# Altium project Q24_ECU_REWORK.PrjPcb (part 2 of 2)

## Sheet IMU.SchDoc
size A4
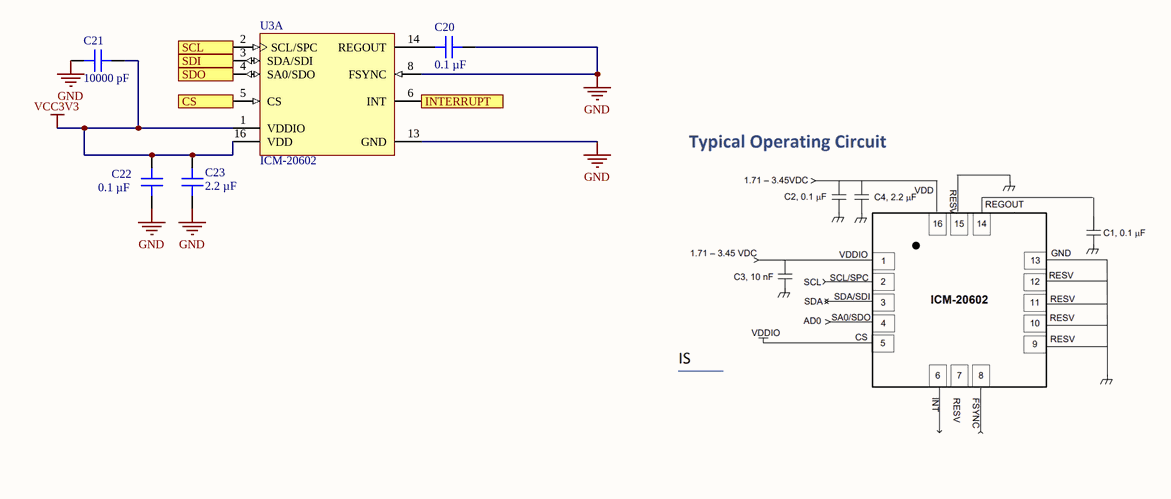
[diagram p12: IMU.SchDoc]

### Parts
C20  0.1 µF  [CAP 0603_1608]
C21  10000 pF  [CAP 0603_1608]
C22  0.1 µF  [CAP 0603_1608]
C23  2.2 µF  [CAP 0603_1608]
U3  ICM-20602  [INSE-I62-16]  (part A of 2)

### Ports
CS, INTERRUPT, SCL, SDI, SDO

### Nets
GND: C20.2 C21.1 C22.1 C23.1 U3.8(FSYNC) U3.13(GND)
VCC3V3: C21.2 C22.2 C23.2 U3.1(VDDIO) U3.16(VDD)
NetC20_1: C20.1 U3.14(REGOUT)
NetU3_2: U3.2(SCL/SPC) ; port SCL
NetU3_3: U3.3(SDA/SDI) ; port SDI
NetU3_4: U3.4(SA0/SDO) ; port SDO
NetU3_5: U3.5(CS) ; port CS
NetU3_6: U3.6(INT) ; port INTERRUPT

### Library data of the parts
C20 C22 = C0603C104K5RAC7411: CAP CER 0.1UF 50V X7R 0603; manufacturer: KEMET; Tolerance: ±10%; Part Number: C0603C104K5RAC7411; Value: 0.1 µF; Applications: Bypass, Decoupling; Capacitance: 0.1 µF; componentlink1description: Datasheet; componentlink1url: https://api.kemet.com/component-edge/download/datasheet/C0603C104K5RAC7411.pdf; componentlink2description: DigiKey Link; componentlink2url: https://www.digikey.com/en/products/detail/kemet/C0603C104K5RAC7411/3317013; Device Package: 0603 (1608 Metric); lastupdated: 2023-06-07 7:13:18 PM; Lifecycle Status: Active; Minimum Order: 1; Mounting Type: Surface Mount, MLCC; Operating Temperature: -55°C ~ 125°C; Package / Case: 0603 (1608 Metric); packaging: TapeAndReel; partid: 2233; Part Status: Active; price: 0.01; series: SMD Comm X7R; Size / Dimension: 0.063" L x 0.031" W (1.60mm x 0.80mm); Supplier 1: DigiKey; Supplier Part Number 1: 399-C0603C104K5RAC7411CT-ND; Temperature Coefficient: X7R; Thickness (Max): 0.035" (0.90mm); Voltage - Rated: 50V
C21 = C0603C103K4RECAUTO: CAP CER 0603 10NF 16V X7R 10%; manufacturer: KEMET; Part Number: C0603C103K4RECAUTO; Value: 10000 pF; Applications: Automotive, ESD Protection; Capacitance: 10000 pF; componentlink1description: Datasheet; componentlink1url: https://api.kemet.com/component-edge/download/datasheet/C0603C103K4RECAUTO.pdf; componentlink2description: DigiKey Link; componentlink2url: https://www.digikey.com/en/products/detail/kemet/C0603C103K4RECAUTO/8640474; Device Package: 0603 (1608 Metric); lastupdated: 2023-06-07 7:13:03 PM; Lifecycle Status: Active; Minimum Order: 1; Mounting Type: Surface Mount, MLCC; Operating Temperature: -55°C ~ 125°C; Package / Case: 0603 (1608 Metric); packaging: TapeAndReel; partid: 8251; Part Status: Active; price: 0.01; Ratings: AEC-Q200; series: ESD SMD Auto X7R; Size / Dimension: 0.063" L x 0.031" W (1.60mm x 0.80mm); Supplier 1: DigiKey; Supplier Part Number 1: 399-17880-1-ND; Temperature Coefficient: X7R; Thickness (Max): 0.034" (0.87mm); Tolerance: ±10%; Voltage - Rated: 16V
C23 = CC0603ZRY5V6BB225: CAP CER 2.2UF 10V Y5V 0603; manufacturer: Yageo; Temperature Coefficient: Y5V (F); Tolerance: -20%, +80%; Part Number: CC0603ZRY5V6BB225; Value: 2.2 µF; Applications: General Purpose; Capacitance: 2.2 µF; componentlink1description: Datasheet; componentlink1url: http://www.yageo.com/documents/recent/UPY-GPHC_Y5V_6.3V-to-50V_8.pdf; componentlink2description: DigiKey Link; componentlink2url: https://www.digikey.com/en/products/detail/yageo/CC0603ZRY5V6BB225/2833615; Device Package: 0603 (1608 Metric); lastupdated: 2023-06-07 7:13:18 PM; Lifecycle Status: Active; Minimum Order: 1; Mounting Type: Surface Mount, MLCC; Operating Temperature: -30°C ~ 85°C; Package / Case: 0603 (1608 Metric); packaging: TapeAndReel; partid: 2248; Part Status: Active; price: 0.01; series: CC; Size / Dimension: 0.063" L x 0.031" W (1.60mm x 0.80mm); Supplier 1: DigiKey; Supplier Part Number 1: 311-1450-1-ND; Thickness (Max): 0.035" (0.90mm); Voltage - Rated: 10V
U3 = CMP-2000-07589-1: High Performance 6-Axis MEMS MotionTracking(TM) Device, 1.71 to 3.45 V, -40 to 85 degC, 16-Pin LGA, RoHS; Manufacturer: InvenSense; Sensor Type: Temperature; Output Type: I2C; RoHSCompliant: True; Datasheet Version: Rev. 1.0, 10/2016; Datasheet URL: http://www.invensense.com/wp-content/uploads/2016/10/DS-000176-ICM-20602-v1.0.pdf; Min Operating Temperature: -40degC; Mounting Technology: SurfaceMount; Max Operating Temperature: 85degC; Manufacturer URL: http://www.invensense.com/; Package Reference: I62-16; Package Description: 16-Pin Land Grid Array, Body 3 x 3 mm, Pitch 0.5 mm

## Sheet 5VBulkhead.SchDoc
size A4
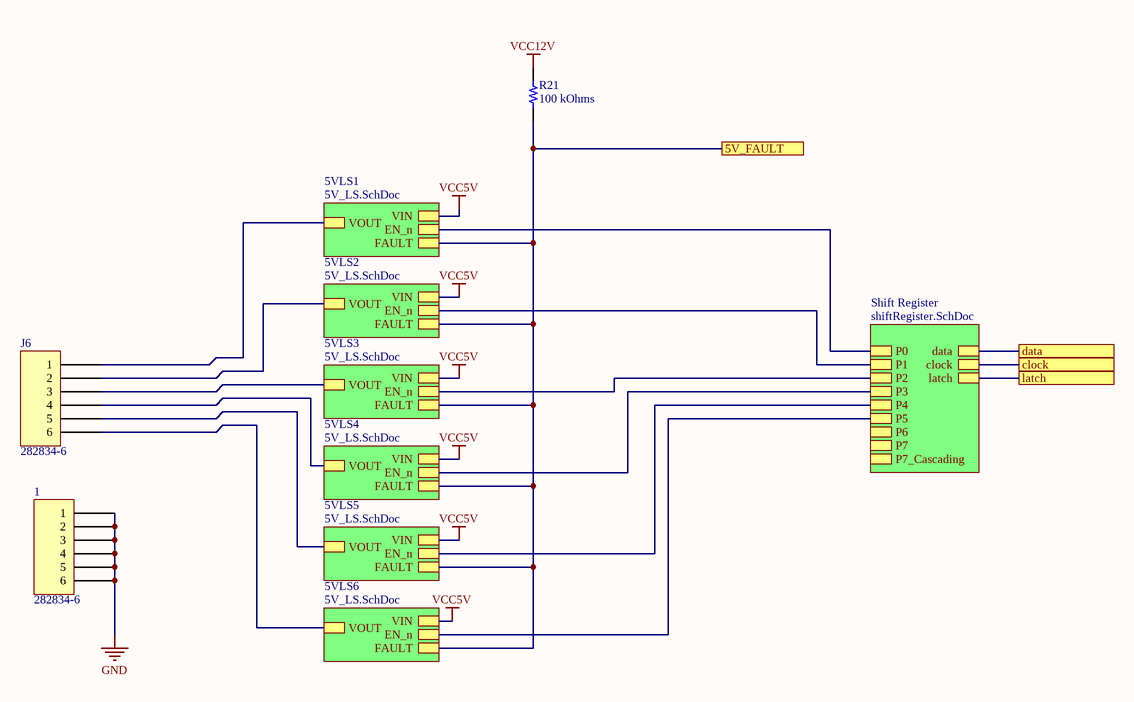
[diagram p13: 5VBulkhead.SchDoc]

### Parts
1  282834-6  [TE 282834-6]
J6  282834-6  [TE 282834-6]
R21  100 kOhms  [RES 0603_1608]

### Sub-sheets
5VLS1 = 5V_LS.SchDoc: VIN, VOUT, EN_n, FAULT
5VLS2 = 5V_LS.SchDoc: VIN, VOUT, EN_n, FAULT
5VLS3 = 5V_LS.SchDoc: VIN, VOUT, EN_n, FAULT
5VLS4 = 5V_LS.SchDoc: VIN, VOUT, EN_n, FAULT
5VLS5 = 5V_LS.SchDoc: VIN, VOUT, EN_n, FAULT
5VLS6 = 5V_LS.SchDoc: VIN, VOUT, EN_n, FAULT
Shift Register = shiftRegister.SchDoc: P0, P1, P2, P3, P4, P5, P6, P7, P7_Cascading, data, clock, latch

### Ports
5V_FAULT, clock, data, latch

### Nets
GND: 1.1 1.2 1.3 1.4 1.5 1.6
VCC5V: sheet 5VLS1/VIN, sheet 5VLS2/VIN, sheet 5VLS3/VIN, sheet 5VLS4/VIN, sheet 5VLS5/VIN, sheet 5VLS6/VIN
VCC12V: R21.2
NetC25_5VLS1_2: J6.1 ; sheet 5VLS1/VOUT
NetC25_5VLS2_2: J6.2 ; sheet 5VLS2/VOUT
NetC25_5VLS3_2: J6.3 ; sheet 5VLS3/VOUT
NetC25_5VLS4_2: J6.4 ; sheet 5VLS4/VOUT
NetC25_5VLS5_2: J6.5 ; sheet 5VLS5/VOUT
NetC25_5VLS6_2: J6.6 ; sheet 5VLS6/VOUT
NetIC2_5VLS1_3: sheet Shift Register/P0, sheet 5VLS1/EN_n
NetIC2_5VLS1_8: R21.1 ; port 5V_FAULT, sheet 5VLS1/FAULT, sheet 5VLS2/FAULT, sheet 5VLS3/FAULT, sheet 5VLS4/FAULT, sheet 5VLS5/FAULT, sheet 5VLS6/FAULT
NetIC2_5VLS2_3: sheet Shift Register/P1, sheet 5VLS2/EN_n
NetIC2_5VLS3_3: sheet Shift Register/P2, sheet 5VLS3/EN_n
NetIC2_5VLS4_3: sheet Shift Register/P3, sheet 5VLS4/EN_n
NetIC2_5VLS5_3: sheet Shift Register/P4, sheet 5VLS5/EN_n
NetIC2_5VLS6_3: sheet Shift Register/P5, sheet 5VLS6/EN_n
NetU4_11: port clock, sheet Shift Register/clock
NetU4_12: port latch, sheet Shift Register/latch
NetU4_14: port data, sheet Shift Register/data

### Library data of the parts
1 J6 = 282834-6: TERM BLK 6P SIDE ENT 2.54MM PCB; Manufacturer: TE Connectivity AMP Connectors; Current: 10A; Mating Orientation: Horizontal with Board; Number of Levels: 1; Pitch: 0.100" (2.54mm); Positions Per Level: 6; Voltage: 150V; Wire Gauge: 16-30 AWG; Wire Termination: Screw - Rising Cage Clamp; Part Number: 282834-6; Color: Green; ComponentLink1Description: Datasheet; ComponentLink1URL: https://www.te.com/commerce/DocumentDelivery/DDEController?Action=srchrtrv&DocNm=282834&DocType=Customer+Drawing&DocLang=English; ComponentLink2Description: DigiKey Link; ComponentLink2URL: http://digikey.com/product-detail/en/te-connectivity-amp-connectors/282834-6/A98337-ND/1153267; LastUpdated: 2020-01-15 4:16:31 AM; Lifecycle Status: Active; Minimum Order: 1; Mounting Type: Through Hole; Packaging: Bulk; Part Status: Active; Price: 4.72; Series: Buchanan; Supplier 1: DigiKey; Supplier Part Number 1: A98337-ND
R21 = RNCS0603BKE100K: RES 100K OHM 0.1% 1/16W 0603; Manufacturer: Stackpole Electronics Inc; Power (Watts): 0.063W, 1/16W; Temperature Coefficient: ±25ppm/°C; Part Number: RNCS0603BKE100K; Value: 100 kOhms; ComponentLink1Description: Datasheet; ComponentLink1URL: https://www.seielect.com/catalog/sei-rncs_rnch.pdf; ComponentLink2Description: DigiKey Link; ComponentLink2URL: https://www.digikey.com/en/products/detail/stackpole-electronics-inc/RNCS0603BKE100K/1708835; Composition: Thin Film; Device Package: 0603 (1608 Metric); Features: Anti-Corrosive, Automotive AEC-Q200, Moisture Resistant; Height - Seated (Max): 0.022" (0.55mm); LastUpdated: 2023-06-08 7:45:17 PM; Lifecycle Status: Active; Minimum Order: 1; Number of Terminations: 2; Operating Temperature: -55°C ~ 155°C; Package / Case: 0603 (1608 Metric); Packaging: TapeAndReel; PartId: 4849; Part Status: Active; Price: 0.07; Ratings: AEC-Q200; Resistance: 100 kOhms; Series: RNCS; Size / Dimension: 0.061" L x 0.031" W (1.55mm x 0.80mm); Supplier 1: DigiKey; Supplier Part Number 1: RNCS0603BKE100KCT-ND; Supplier Device Package: 0603; Tolerance: ±0.1%

## Sheet 5V_LS.SchDoc
size A4
Used 6 times, as channels 5VLS1, 5VLS2, 5VLS3, 5VLS4, 5VLS5, 5VLS6. Parts and nets are listed once, with the designators drawn on the sheet.
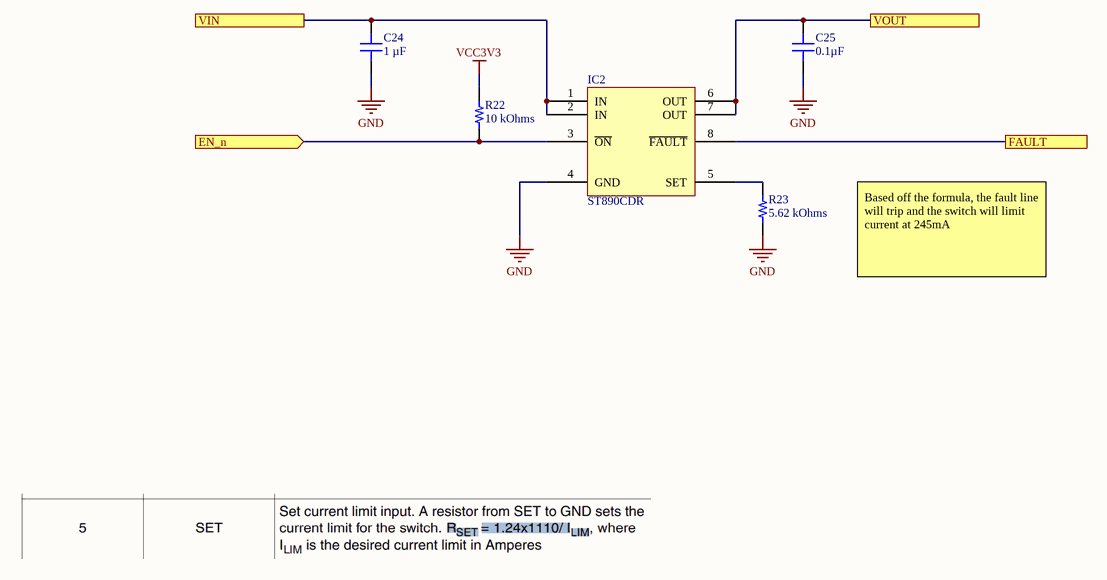
[diagram p14: 5V_LS.SchDoc]

### Parts
C24  1 µF  [CAP 0402_1005]
C25  0.1µF  [CAP 0402_1005]
IC2  ST890CDR  [ST SOIC-8N]
R22  10 kOhms  [RES 0402_1005]
R23  5.62 kOhms  [RES 0402_1005]

### Ports
EN_n (in), FAULT, VIN, VOUT

### Nets
GND: C24.1 C25.1 IC2.4(GND) R23.1
VCC3V3: R22.2
EN_n: IC2.3(~{ON}) R22.1 ; port EN_n
FAULT: IC2.8(~{FAULT}) ; port FAULT
VIN: C24.2 IC2.1(IN) IC2.2(IN) ; port VIN
VOUT: C25.2 IC2.6(OUT) IC2.7(OUT) ; port VOUT
NetIC2_5: IC2.5(SET) R23.2

### Channels
5VLS1: designators end in _5VLS1; ports EN_n=NetIC2_5VLS1_3 FAULT=NetIC2_5VLS1_8 VIN=VCC5V VOUT=NetC25_5VLS1_2
5VLS2: designators end in _5VLS2; ports EN_n=NetIC2_5VLS2_3 FAULT=NetIC2_5VLS1_8 VIN=VCC5V VOUT=NetC25_5VLS2_2
5VLS3: designators end in _5VLS3; ports EN_n=NetIC2_5VLS3_3 FAULT=NetIC2_5VLS1_8 VIN=VCC5V VOUT=NetC25_5VLS3_2
5VLS4: designators end in _5VLS4; ports EN_n=NetIC2_5VLS4_3 FAULT=NetIC2_5VLS1_8 VIN=VCC5V VOUT=NetC25_5VLS4_2
5VLS5: designators end in _5VLS5; ports EN_n=NetIC2_5VLS5_3 FAULT=NetIC2_5VLS1_8 VIN=VCC5V VOUT=NetC25_5VLS5_2
5VLS6: designators end in _5VLS6; ports EN_n=NetIC2_5VLS6_3 FAULT=NetIC2_5VLS1_8 VIN=VCC5V VOUT=NetC25_5VLS6_2

### Notes on the sheet
- Based off the formula, the fault line will trip and the switch will limit current at 245mA

### Library data of the parts
C24 = GRM155C71A105KE11D: CAP CER 1UF 10V X7S 0402; manufacturer: Murata Electronics; Tolerance: ±10%; Part Number: GRM155C71A105KE11D; Value: 1 µF; Applications: General Purpose; Capacitance: 1 µF; componentlink1description: Datasheet; componentlink1url: https://search.murata.co.jp/Ceramy/image/img/A01X/G101/ENG/GRM155C71A105KE11-01.pdf; componentlink2description: DigiKey Link; componentlink2url: https://www.digikey.com/en/products/detail/murata-electronics/GRM155C71A105KE11D/6606086; Device Package: 0402 (1005 Metric); lastupdated: 2023-06-04 7:05:15 PM; Lifecycle Status: Active; Minimum Order: 1; Mounting Type: Surface Mount, MLCC; Operating Temperature: -55°C ~ 125°C; Package / Case: 0402 (1005 Metric); packaging: TapeAndReel; partid: 1749; Part Status: Active; price: 0.01; series: GRM; Size / Dimension: 0.039" L x 0.020" W (1.00mm x 0.50mm); Supplier 1: DigiKey; Supplier Part Number 1: 490-14457-1-ND; Temperature Coefficient: X7S; Thickness (Max): 0.024" (0.60mm); Voltage - Rated: 10V
C25 = 0402ZC104KAT2A: CAP CER 0.1UF 10V X7R 0402; manufacturer: AVX Corporation; Tolerance: ±10%; Part Number: 0402ZC104KAT2A; Value: 0.1µF; Applications: General Purpose; Capacitance: 0.1µF; componentlink1description: Datasheet; componentlink1url: http://datasheets.avx.com/X7RDielectric.pdf; componentlink2description: DigiKey Link; componentlink2url: http://digikey.com/product-detail/en/avx-corporation/0402ZC104KAT2A/478-7891-1-ND/3881514; Device Package: 0402 (1005 Metric); lastupdated: 2022-02-08 12:26:59 PM; Lifecycle Status: Active; Minimum Order: 1; Mounting Type: Surface Mount, MLCC; Operating Temperature: -55°C ~ 125°C; Package / Case: 0402 (1005 Metric); packaging: TapeAndReel; partid: 1757; Part Status: Active; price: 0.09; series: -; Size / Dimension: 0.039" L x 0.020" W (1.00mm x 0.50mm); Supplier 1: DigiKey; Supplier Part Number 1: 478-7891-1-ND; Temperature Coefficient: X7R; Thickness (Max): 0.022" (0.55mm); Voltage - Rated: 10V
IC2 = ST890CDR: IC PWR SWITCH P-CHANNEL 1:1 8SO; Manufacturer: STMicroelectronics; Current - Output (Max): 1.2A; Fault Protection: Current Limiting (Adjustable), Over Temperature; Input Type: Non-Inverting; Interface: On/Off; Number of Outputs: 1; Output Configuration: High Side; Rds On (Typ): 75mOhm; Switch Type: General Purpose; Voltage - Load: 2.7V ~ 5.5V; Voltage - Supply (Vcc/Vdd): Not Required; Part Number: ST890CDR; ComponentLink1Description: Datasheet; ComponentLink1URL: http://www.st.com/content/ccc/resource/technical/document/datasheet/1a/8c/51/d8/96/28/4d/63/CD00002878.pdf/files/CD00002878.pdf/jcr:content/translations/en.CD00002878.pdf; ComponentLink2Description: DigiKey Link; ComponentLink2URL: http://digikey.com/product-detail/en/stmicroelectronics/ST890CDR/497-6543-1-ND/1865325; Device Package: 8-SOIC (0.154", 3.90mm Width); LastUpdated: 2020-05-24 9:33:45 PM; Lifecycle Status: Active; Minimum Order: 1; Mounting Type: Surface Mount; Operating Temperature: -40°C ~ 85°C (TA); Output Type: P-Channel; Package / Case: 8-SOIC (0.154", 3.90mm Width); Packaging: TapeAndReel; Part Status: Active; Price: 0.47; Ratio - Input:Output: 1:1; Series: -; Supplier 1: DigiKey; Supplier Part Number 1: 497-6543-1-ND; Supplier Device Package: 8-SO
R22 = RP73PF1E10KBTD: RES 10K OHM 0.1% 1/10W 0402; Manufacturer: TE Connectivity Passive Product; Power (Watts): 0.1W, 1/10W; Temperature Coefficient: ±25ppm/°C; Part Number: RP73PF1E10KBTD; Value: 10 kOhms; ComponentLink1Description: Datasheet; ComponentLink1URL: https://www.te.com/commerce/DocumentDelivery/DDEController?Action=srchrtrv&DocNm=1773272&DocType=DS&DocLang=English; ComponentLink2Description: DigiKey Link; ComponentLink2URL: https://www.digikey.com/en/products/detail/te-connectivity-passive-product/RP73PF1E10KBTD/8260957; Composition: Thin Film; Device Package: 0402 (1005 Metric); Height - Seated (Max): 0.014" (0.35mm); LastUpdated: 2023-06-04 7:27:27 PM; Lifecycle Status: Active; Minimum Order: 1; Number of Terminations: 2; Operating Temperature: -55°C ~ 155°C; Package / Case: 0402 (1005 Metric); Packaging: TapeAndReel; PartId: 2434; Part Status: Active; Price: 0.08; Resistance: 10 kOhms; Series: RP73, Holsworthy; Size / Dimension: 0.039" L x 0.020" W (1.00mm x 0.50mm); Supplier 1: DigiKey; Supplier Part Number 1: A127415CT-ND; Supplier Device Package: 0402; Tolerance: ±0.1%
R23 = RP73PF1E5K62BTD: RES 5.62K OHM 0.1% 1/10W 0402; Manufacturer: TE Connectivity Passive Product; Power (Watts): 0.1W, 1/10W; Temperature Coefficient: ±25ppm/°C; Part Number: RP73PF1E5K62BTD; Value: 5.62 kOhms; ComponentLink1Description: Datasheet; ComponentLink1URL: https://www.te.com/commerce/DocumentDelivery/DDEController?Action=srchrtrv&DocNm=1773272&DocType=DS&DocLang=English; ComponentLink2Description: DigiKey Link; ComponentLink2URL: https://www.digikey.com/en/products/detail/te-connectivity-passive-product/RP73PF1E5K62BTD/8260933; Composition: Thin Film; Device Package: 0402 (1005 Metric); Height - Seated (Max): 0.014" (0.35mm); LastUpdated: 2023-06-04 7:27:27 PM; Lifecycle Status: Active; Minimum Order: 1; Number of Terminations: 2; Operating Temperature: -55°C ~ 155°C; Package / Case: 0402 (1005 Metric); Packaging: TapeAndReel; PartId: 2425; Part Status: Active; Price: 0.08; Resistance: 5.62 kOhms; Series: RP73, Holsworthy; Size / Dimension: 0.039" L x 0.020" W (1.00mm x 0.50mm); Supplier 1: DigiKey; Supplier Part Number 1: A127391CT-ND; Supplier Device Package: 0402; Tolerance: ±0.1%

## Sheet 5V_TO_3V3_VOLTAGE_DIVIDER.SchDoc
size A4
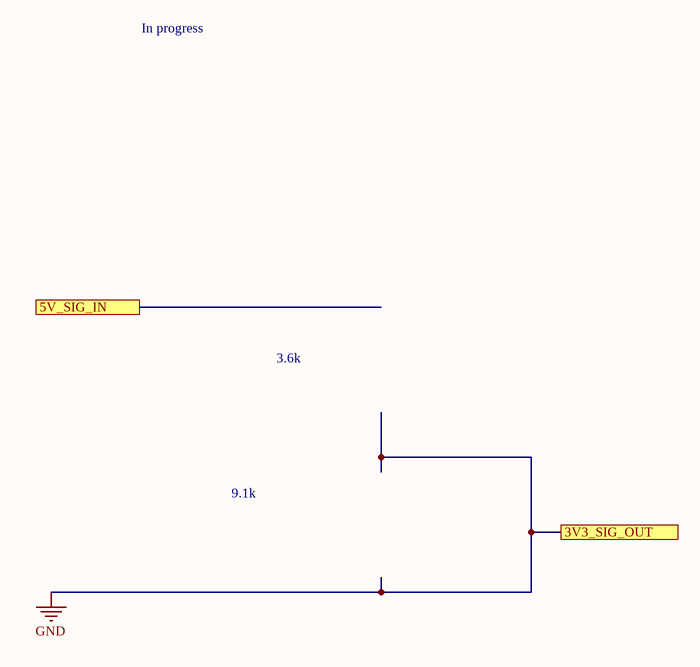
[diagram p15: 5V_TO_3V3_VOLTAGE_DIVIDER.SchDoc]

### Ports
3V3_SIG_OUT, 5V_SIG_IN

### Notes on the sheet
- In progress
- 3.6k
- 9.1k

## Sheet BOARD_POWER.SchDoc
size A4

## Nets that join several sheets
GND: TOP (STLINK-HEADER-.3 STLINK-HEADER-.8), STM32 (13 pins), Microcontroller/12_TO_3_VOLTAGE_DIVIDER (R25_Microcontroller_12_TO_3_VOLTAGE_DIVIDER#1.1), Microcontroller/12_TO_3_VOLTAGE_DIVIDER (R25_Microcontroller_12_TO_3_VOLTAGE_DIVIDER#2.1), Microcontroller/12_TO_3_VOLTAGE_DIVIDER (R25_Microcontroller_12_TO_3_VOLTAGE_DIVIDER#3.1), Microcontroller/12_TO_3_VOLTAGE_DIVIDER (R25_Microcontroller_12_TO_3_VOLTAGE_DIVIDER#4.1), Microcontroller/12_TO_3_VOLTAGE_DIVIDER (R25_Microcontroller_12_TO_3_VOLTAGE_DIVIDER#5.1), Microcontroller/12_TO_3_VOLTAGE_DIVIDER (R25_Microcontroller_12_TO_3_VOLTAGE_DIVIDER#6.1), DebuggerMCU (19 pins), Power (7 pins), DebuggerConnectors (8 pins), 12V_POWER_BULKHEAD (6 pins), 12V Power And Ground/Shift Register (C26_12V_Power_And_Ground_Shift_Register.2 U4_12V_Power_And_Ground_Shift_Register.8 U4_12V_Power_And_Ground_Shift_Register.13), Connectors (D5.2 D6.2 J2.1 J5.1), Buck (14 pins), CAN (C18.1 C19.1 IC1.2), IMU (6 pins), 5VBulkhead (6 pins), Shift Register (C26_Shift_Register.2 U4.8 U4.13), 5VLS1 (C24_5VLS1.1 C25_5VLS1.1 IC2_5VLS1.4 R23_5VLS1.1), 5VLS2 (C24_5VLS2.1 C25_5VLS2.1 IC2_5VLS2.4 R23_5VLS2.1), 5VLS3 (C24_5VLS3.1 C25_5VLS3.1 IC2_5VLS3.4 R23_5VLS3.1), 5VLS4 (C24_5VLS4.1 C25_5VLS4.1 IC2_5VLS4.4 R23_5VLS4.1), 5VLS5 (C24_5VLS5.1 C25_5VLS5.1 IC2_5VLS5.4 R23_5VLS5.1), 5VLS6 (C24_5VLS6.1 C25_5VLS6.1 IC2_5VLS6.4 R23_5VLS6.1)
USB_5V: Power (C15.2 C16.2 D3.A VR1.3), DebuggerConnectors (L1.2)
VCC3V3: STM32 (9 pins), DebuggerMCU (6 pins), DebuggerConnectors (P1.2 R18.2), CAN (C18.2 IC1.5), IMU (5 pins), 5VLS1 (R22_5VLS1.2), 5VLS2 (R22_5VLS2.2), 5VLS3 (R22_5VLS3.2), 5VLS4 (R22_5VLS4.2), 5VLS5 (R22_5VLS5.2), 5VLS6 (R22_5VLS6.2)
VCC3V3DEBUG: DebuggerMCU (7 pins), Power (C14.1 C17.2 D4.A VR1.2)
VCC5V: 12V Power And Ground/Shift Register (C26_12V_Power_And_Ground_Shift_Register.1 U4_12V_Power_And_Ground_Shift_Register.10 U4_12V_Power_And_Ground_Shift_Register.16), Buck (6 pins), CAN (C19.2 IC1.3), Shift Register (C26_Shift_Register.1 U4.10 U4.16), 5VLS1 (C24_5VLS1.2 IC2_5VLS1.1 IC2_5VLS1.2), 5VLS2 (C24_5VLS2.2 IC2_5VLS2.1 IC2_5VLS2.2), 5VLS3 (C24_5VLS3.2 IC2_5VLS3.1 IC2_5VLS3.2), 5VLS4 (C24_5VLS4.2 IC2_5VLS4.1 IC2_5VLS4.2), 5VLS5 (C24_5VLS5.2 IC2_5VLS5.1 IC2_5VLS5.2), 5VLS6 (C24_5VLS6.2 IC2_5VLS6.1 IC2_5VLS6.2)
VCC12V: Connectors (D5.1 D6.1 J2.2 J5.2), Buck (5 pins), 5VBulkhead (R21.2)
12-3_1: STM32 (U1.15), Microcontroller/12_TO_3_VOLTAGE_DIVIDER (R24_Microcontroller_12_TO_3_VOLTAGE_DIVIDER#1.1 R25_Microcontroller_12_TO_3_VOLTAGE_DIVIDER#1.2)
12-3_2: STM32 (U1.16), Microcontroller/12_TO_3_VOLTAGE_DIVIDER (R24_Microcontroller_12_TO_3_VOLTAGE_DIVIDER#2.1 R25_Microcontroller_12_TO_3_VOLTAGE_DIVIDER#2.2)
12-3_3: STM32 (U1.17), Microcontroller/12_TO_3_VOLTAGE_DIVIDER (R24_Microcontroller_12_TO_3_VOLTAGE_DIVIDER#3.1 R25_Microcontroller_12_TO_3_VOLTAGE_DIVIDER#3.2)
12-3_4: STM32 (U1.18), Microcontroller/12_TO_3_VOLTAGE_DIVIDER (R24_Microcontroller_12_TO_3_VOLTAGE_DIVIDER#4.1 R25_Microcontroller_12_TO_3_VOLTAGE_DIVIDER#4.2)
12-3_5: STM32 (U1.26), Microcontroller/12_TO_3_VOLTAGE_DIVIDER (R24_Microcontroller_12_TO_3_VOLTAGE_DIVIDER#5.1 R25_Microcontroller_12_TO_3_VOLTAGE_DIVIDER#5.2)
12-3_6: STM32 (U1.25), Microcontroller/12_TO_3_VOLTAGE_DIVIDER (R24_Microcontroller_12_TO_3_VOLTAGE_DIVIDER#6.1 R25_Microcontroller_12_TO_3_VOLTAGE_DIVIDER#6.2)
12V_CLOCK: STM32 (U1.78), 12V Power And Ground/Shift Register (U4_12V_Power_And_Ground_Shift_Register.11)
12V_DATA: STM32 (U1.35), 12V Power And Ground/Shift Register (U4_12V_Power_And_Ground_Shift_Register.14)
12V_LATCH: STM32 (U1.77), 12V Power And Ground/Shift Register (U4_12V_Power_And_Ground_Shift_Register.12)
NetC25_5VLS1_2: 5VBulkhead (J6.1), 5VLS1 (C25_5VLS1.2 IC2_5VLS1.6 IC2_5VLS1.7)
NetC25_5VLS2_2: 5VBulkhead (J6.2), 5VLS2 (C25_5VLS2.2 IC2_5VLS2.6 IC2_5VLS2.7)
NetC25_5VLS3_2: 5VBulkhead (J6.3), 5VLS3 (C25_5VLS3.2 IC2_5VLS3.6 IC2_5VLS3.7)
NetC25_5VLS4_2: 5VBulkhead (J6.4), 5VLS4 (C25_5VLS4.2 IC2_5VLS4.6 IC2_5VLS4.7)
NetC25_5VLS5_2: 5VBulkhead (J6.5), 5VLS5 (C25_5VLS5.2 IC2_5VLS5.6 IC2_5VLS5.7)
NetC25_5VLS6_2: 5VBulkhead (J6.6), 5VLS6 (C25_5VLS6.2 IC2_5VLS6.6 IC2_5VLS6.7)
NetIC2_5VLS1_3: Shift Register (U4.15), 5VLS1 (IC2_5VLS1.3 R22_5VLS1.1)
NetIC2_5VLS1_8: 5VBulkhead (R21.1), 5VLS1 (IC2_5VLS1.8), 5VLS2 (IC2_5VLS2.8), 5VLS3 (IC2_5VLS3.8), 5VLS4 (IC2_5VLS4.8), 5VLS5 (IC2_5VLS5.8), 5VLS6 (IC2_5VLS6.8)
NetIC2_5VLS2_3: Shift Register (U4.1), 5VLS2 (IC2_5VLS2.3 R22_5VLS2.1)
NetIC2_5VLS3_3: Shift Register (U4.2), 5VLS3 (IC2_5VLS3.3 R22_5VLS3.1)
NetIC2_5VLS4_3: Shift Register (U4.3), 5VLS4 (IC2_5VLS4.3 R22_5VLS4.1)
NetIC2_5VLS5_3: Shift Register (U4.4), 5VLS5 (IC2_5VLS5.3 R22_5VLS5.1)
NetIC2_5VLS6_3: Shift Register (U4.5), 5VLS6 (IC2_5VLS6.3 R22_5VLS6.1)
NetR3_2: TOP (R3.2), STM32 (U1.24)
NetR4_2: TOP (R4.2), STM32 (U1.23)
ST_JTCK: DebuggerMCU (U2.37), DebuggerConnectors (P1.4)
ST_JTMS: DebuggerMCU (U2.34), DebuggerConnectors (P1.3)
T_JTCK: TOP (R2.1), DebuggerMCU (U2.26)
T_JTMS: TOP (R1.1), DebuggerMCU (R10.2 U2.27)
UART_RX: TOP (R4.1), DebuggerMCU (U2.13)
UART_TX: TOP (R3.1), DebuggerMCU (U2.12)
USB_D_N: DebuggerMCU (U2.32), DebuggerConnectors (J1.2)
USB_D_P: DebuggerMCU (U2.33), DebuggerConnectors (J1.3 R18.1)